# EAGLE design team4-selo-atmega32u4-usb (EAGLE 9.5.1)

## Sheet 1 of 2
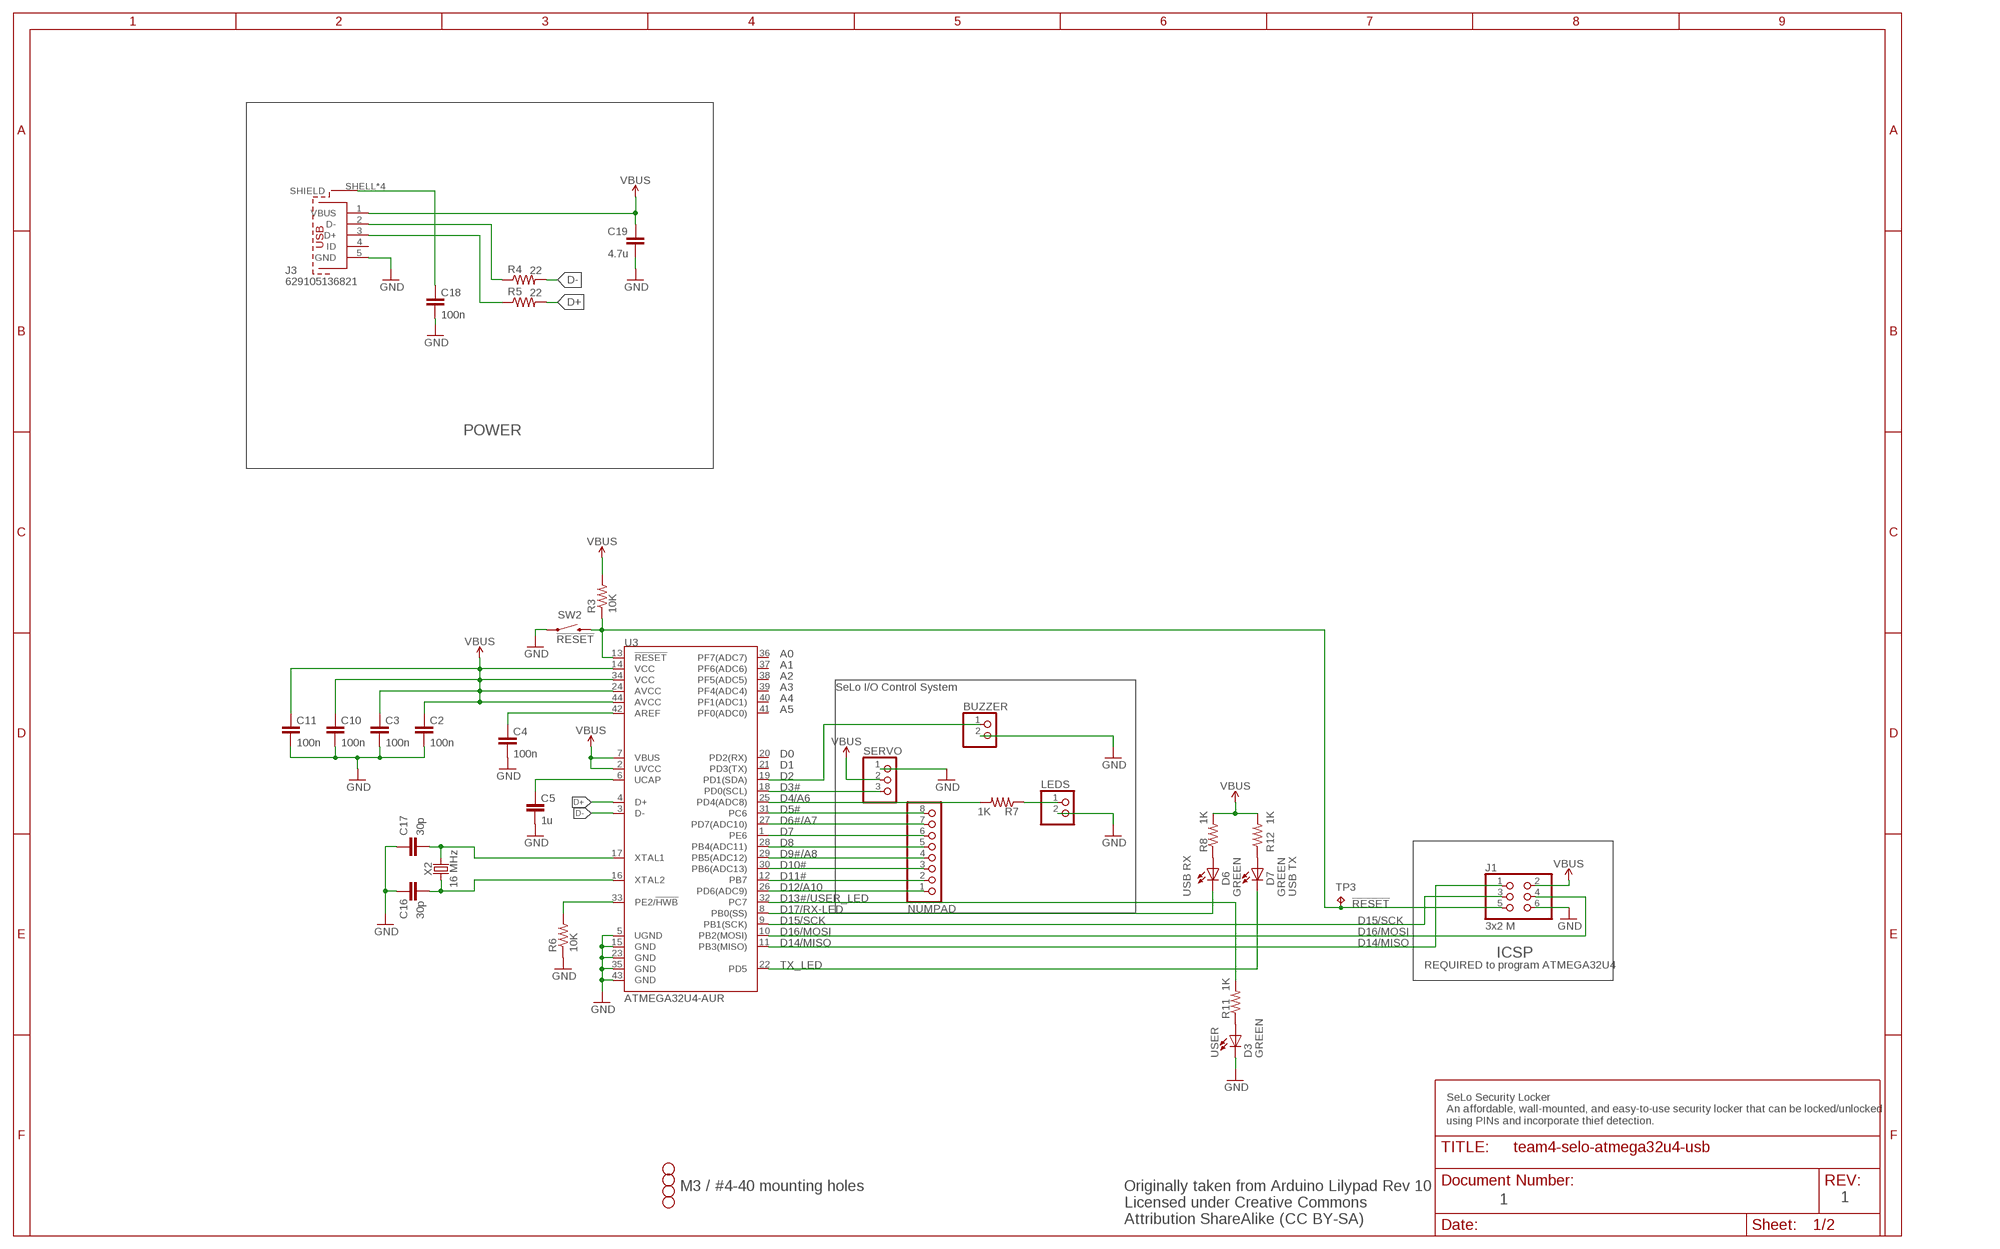
[diagram p0: schematic, sheet 1]

### Parts
BUZZER  PINHD-1X2  [1X02]
C2  100n  C-EUC0805K  [C0805K]
C3  100n  C-EUC0805K  [C0805K]
C4  100n  C-EUC0805K  [C0805K]
C5  1u  C-EUC0805K  [C0805K]
C10  100n  C-EUC0805K  [C0805K]
C11  100n  C-EUC0805K  [C0805K]
C16  30p  C-EUC0805K  [C0805K]
C17  30p  C-EUC0805K  [C0805K]
C18  100n  C-EUC0805K  [C0805K]
C19  4.7u  C-EUC0805K  [C0805K]
D3  GREEN  LEDCHIP-LED0805  [CHIP-LED0805]
D6  GREEN  LEDCHIP-LED0805  [CHIP-LED0805]
D7  GREEN  LEDCHIP-LED0805  [CHIP-LED0805]
H1  STAND-OFF  [STAND-OFF]
H2  STAND-OFF  [STAND-OFF]
H3  STAND-OFF  [STAND-OFF]
H4  STAND-OFF  [STAND-OFF]
J1  3x2 M  PINHD-2X3  [2X03]
J3  629105136821  [629105136821]
LEDS  PINHD-1X2  [1X02]
NUMPAD  PINHD-1X8  [1X08]
R3  10K  R-US_R0805  [R0805]
R4  22  R-US_R0805  [R0805]
R5  22  R-US_R0805  [R0805]
R6  10K  R-US_R0805  [R0805]
R7  1K  R-US_R0805  [R0805]
R8  1K  R-US_R0805  [R0805]
R11  1K  R-US_R0805  [R0805]
R12  1K  R-US_R0805  [R0805]
SERVO  PINHD-1X3  [1X03]
SW2  !RESET  SWITCH-MOMENTARY-2SMD  [TACTILE_SWITCH_SMD]
TP3  TPPAD1-13  [P1-13]
U3  ATMEGA32U4-AUR  ATMEGA32U4TQFP-44  [TQFP44]
X2  16 MHz  CRYSTALSMD-HC49UP  [HC49UP]

### Nets
!RESET: J1.5 R3.1 SW2.3 TP3.TP U3.13(!RESET)
AREF: C4.1 U3.42(AREF)
D13#/USER_LED: R11.2 U3.32(PC7)
D14/MISO: J1.1 U3.11(PB3(MISO))
D15/SCK: J1.3 U3.9(PB1(SCK))
D16/MOSI: J1.4 U3.10(PB2(MOSI))
D17/RX-LED: D6.C U3.8(PB0(SS))
D+: R5.2 U3.4(D+)
D-: R4.2 U3.3(D-)
GND: BUZZER.2 C2.2 C3.2 C4.2 C5.2 C10.2 C11.2 C16.2 C17.2 C18.2 C19.2 D3.C J1.6 J3.5(GND) LEDS.2 R6.1 SERVO.1 SW2.1 U3.5(UGND) U3.15(GND) U3.23(GND) U3.35(GND) U3.43(GND)
N$1: SERVO.3 U3.18(PD0(SCL))
N$2: NUMPAD.8 U3.31(PC6)
N$5: NUMPAD.7 U3.27(PD7(ADC10))
N$6: NUMPAD.6 U3.1(PE6)
N$8: NUMPAD.5 U3.28(PB4(ADC11))
N$9: NUMPAD.4 U3.29(PB5(ADC12))
N$10: NUMPAD.3 U3.30(PB6(ADC13))
N$11: NUMPAD.2 U3.12(PB7)
N$12: NUMPAD.1 U3.26(PD6(ADC9))
N$13: D3.A R11.1
N$14: C18.1 J3.SHELL1(SHIELD) J3.SHELL2(SHIELD) J3.SHELL3(SHIELD) J3.SHELL(SHIELD)
N$15: D6.A R8.1
N$16: D7.A R12.1
N$17: R7.2 U3.25(PD4(ADC8))
N$18: LEDS.1 R7.1
N$19: J3.2(D-) R4.1
N$20: J3.3(D+) R5.1
N$21: BUZZER.1 U3.19(PD1(SDA))
PE2/!HWB: R6.2 U3.33(PE2/!HWB)
TX_LED: D7.C U3.22(PD5)
UCAP: C5.1 U3.6(UCAP)
VBUS: C2.1 C3.1 C10.1 C11.1 C19.1 J1.2 J3.1(VBUS) R3.2 R8.2 R12.2 SERVO.2 U3.2(UVCC) U3.7(VBUS) U3.14(VCC) U3.24(AVCC) U3.34(VCC) U3.44(AVCC)
XTAL1: C17.1 U3.17(XTAL1) X2.2
XTAL2: C16.1 U3.16(XTAL2) X2.1
Unconnected: J3.4(ID) U3.20(PD2(RX)) U3.21(PD3(TX)) U3.36(PF7(ADC7)) U3.37(PF6(ADC6)) U3.38(PF5(ADC5)) U3.39(PF4(ADC4)) U3.40(PF1(ADC1)) U3.41(PF0(ADC0))

### Notes on the sheet
- POWER
- A0
- A1
- A2
- A3 | SeLo I/O Control System
- A4
- A5
- D0
- D1
- D2
- D3#
- D4/A6
- D5#
- D6#/A7
- D7
- D8
- D9#/A8
- D10#
- D11#
- D12/A10
- USB RX | USB TX
- ICSP
- REQUIRED to program ATMEGA32U4
- USER
- SeLo Security Locker
  An affordable, wall-mounted, and easy-to-use security locker that can be locked/unlocked 
  using PINs and incorporate thief detection.
- M3 / #4-40 mounting holes
- 1 | 1
- Originally taken from Arduino Lilypad Rev 10
  Licensed under Creative Commons 
  Attribution ShareAlike (CC BY-SA)

## Sheet 2 of 2

## Library data of the parts
BUZZER LEDS = pinhead:PINHD-1X2: PIN HEADER
C2-C4 C10 C11 C18 = rcl:C-EU: CAPACITOR, European symbol; DESC: CAP CER 0.1UF 50V X7R 0805; MFR: Samsung; MPN: CL21B104KBCNNNC; SPICEPREFIX: C
C5 = rcl:C-EU: CAPACITOR, European symbol; DESC: CAP CER 1UF 16V X7R 0805; MFR: Samsung; MPN: CL21B105KOFNNNG; SPICEPREFIX: C
C16 = rcl:C-EU: CAPACITOR, European symbol; DESC: CAP CER 30PF 50V C0G/NP0 0805; MFR: Samsung; MPN: CL21C300JBANNNC; SPICEPREFIX: C
C17 = rcl:C-EU: CAPACITOR, European symbol; DESC: CAP CER 30PF 50V C0G/NP0 0805; MFR: Samsung; MPN: CL21C180JBANNNC; SPICEPREFIX: C
C19 = rcl:C-EU: CAPACITOR, European symbol; DESC: CAP CER 4.7UF 16V X5R 0805; MFR: Samsung; MPN: CL21A475KOFNNNE; SPICEPREFIX: C
D3 D6 D7 = led:LED: LED OSRAM: - CHIPLED LG R971, LG N971, LY N971, LG Q971, LY Q971, LO R971, LY R971 LH N974, LH R974 LS Q976, LO Q976, LY Q976 LO Q996 - Hyper CHIPLED LW Q18S LB Q993, LB Q99A, LB R99A - SideLED LS A670, LO A670, LY A670, LG A670, LP A670 LB A673, LV A673, LT A673, LW A673 LH A674 LY A675 LS A676, LA A676, LO A676, LY A676, LW A676 LS A679, LY A679, LG A679 - Hyper Micro SIDELED® LS Y876, LA Y876, LO Y876, LY Y876 LT Y87S - SmartLED LW L88C, LW L88S LB L89C, LB L89S, LG L890 LS L89K, LO L89K, LY L89K LS L896, LA L896, LO L896, LY L896 - TOPLED LS T670, LO T670, LY T670, LG T670, LP T670 LSG T670, LSP T670, LSY T670, LOP T670, LYG T670 LG T671, LOG T671, LSG T671 LB T673, LV T673, LT T673, LW T673 LH T674 LS T676, LA T676, LO T676, LY T676, LB T676, LH T676, LSB T676, LW T676 LB T67C, LV T67C, LT T67C, LS T67K, LO T67K, LY T67K, LW E67C LS E67B, LA E67B, LO E67B, LY E67B, LB E67C, LV E67C, LT E67C LW T67C LS T679, LY T679, LG T679 LS T770, LO T770, LY T770, LG T770, LP T770 LB T773, LV T773, LT T773, LW T773 LH T774 LS E675, LA E675, LY E675, LS T675 LS T776, LA T776, LO T776, LY T776, LB T776 LHGB T686 LT T68C, LB T68C - Hyper Mini TOPLED® LB M676 - Mini TOPLED Santana® LG M470 LS M47K, LO M47K, LY M47K Source: http://www.osram.convergy.de LUXEON: - LUMILED® LXK2-PW12-R00, LXK2-PW12-S00, LXK2-PW14-U00, LXK2-PW14-V00 LXK2-PM12-R00, LXK2-PM12-S00, LXK2-PM14-U00 LXK2-PE12-Q00, LXK2-PE12-R00, LXK2-PE12-S00, LXK2-PE14-T00, LXK2-PE14-U00 LXK2-PB12-K00, LXK2-PB12-L00, LXK2-PB12-M00, LXK2-PB14-N00, LXK2-PB14-P00, LXK2-PB14-Q00 LXK2-PR12-L00, LXK2-PR12-M00, LXK2-PR14-Q00, LXK2-PR14-R00 LXK2-PD12-Q00, LXK2-PD12-R00, LXK2-PD12-S00 LXK2-PH12-R00, LXK2-PH12-S00 LXK2-PL12-P00, LXK2-PL12-Q00, LXK2-PL12-R00 Source: www.luxeon.com KINGBRIGHT: KA-3528ASYC Source: www.kingbright.com; DESC: LED GREEN CLEAR 0805 SMD; MFR: Würth Elektronik; MPN: 150080GS75000
H1-H4 = SparkFun-Hardware:STAND-OFF: Stand Off Drill holes for mechanically mounting via screws, standoffs, etc. Note: Use the keepout ring to avoid running the screw head into surrounding components. Variant Overviews STAND-OFF - Mechanical footprint for a #4 phillips button head screw. STAND-OFF-TIGHT - Mechanical footprint for a #4 phillips button head screw, Example SparkFun Products Screw - Phillips Head (1/4", 4-40, 10 pack) <https://www.sparkfun.com/products/10453> (PRT-10453) Screw - Phillips Head (1/2", 4-40, 10 pack) <https://www.sparkfun.com/products/10452> (PRT-10452) Screw - Phillips Head (3/4", 4-40, 10 pack) <https://www.sparkfun.com/products/10451> (PRT-10451) Screw - Phillips Head (1", 4-40, 10 pack) <https://www.sparkfun.com/products/10450> (PRT-10450)
J1 = SmartPrj:PINHD-2X3: PIN HEADER; DESC: CONN HEADER VERT 6POS 2ROW 2.54MM; MFR: Harwin; MPN: M20-9980345
J3 = Wurth_Elektronik_Electromechanic_Input-Output_Connectors_rev19b:629105136821: WR-COM SMT Horizontal 5 Contacts Micro USB Type B,5 pins=>Code : Con_I-O_COM_MicroUSB_629105136821 <http://katalog.we-online.de/media/images/eican/Con_I-O_COM_MicroUSB_629105136821_pf2.jpg> Details see: http://katalog.we-online.de/en/em/COM_MICRO_SMT_TYPE_B_HORIZONTAL/629105136821?m Created 2014-07-09, Karrer Zheng 2014 (C) Würth Elektronik; DESC: CONN RCPT USB2.0 MICRO B SMD R/A; MFR: Wurth; MPN: 629105136821
NUMPAD = pinhead:PINHD-1X8: PIN HEADER
R3 R6 = rcl:R-US_: RESISTOR, American symbol; DESC: RES SMD 10K OHM 1% 1/8W 0805; MFR: Yageo; MPN: RC0805FR-0710KL; SPICEPREFIX: R
R4 R5 = rcl:R-US_: RESISTOR, American symbol; DESC: RES SMD 22 OHM 1% 1/8W 0805; MFR: Yageo; MPN: RC0805FR-0722RL; SPICEPREFIX: R
R7 R8 R11 R12 = rcl:R-US_: RESISTOR, American symbol; DESC: RES SMD 1K OHM 1% 1/8W 0805; MFR: Yageo; MPN: RC0805FR-071KL; SPICEPREFIX: R
SERVO = pinhead:PINHD-1X3: PIN HEADER
SW2 = SparkFun-Electromechanical:SWITCH-MOMENTARY-2: Various NO switches- pushbuttons, reed, etc; DESC: SWITCH TACTILE SPST-NO 0.05A 12V; MFR: C&K; MPN: RS-187R05A2-DS MT RT
TP3 = testpad:TP: Test pad
U3 = SparkFun-IC-Microcontroller:ATMEGA32U4: Atmel MCU, 32KByte Atmel 44-pin 8-bit Microcontroller with 32KBytes of ISP Flash and USB Controller Datasheet <http://cdn.sparkfun.com/datasheets/Dev/Arduino/Boards/ATMega32U4.pdf> SparkFun Products LilyPad Arduino USB - ATmega32U4 Board <https://www.sparkfun.com/products/12049> (DEV-12049) Pro Micro - 5V/16MHz <https://www.sparkfun.com/products/12640> (DEV-12640) Pro Micro - 3.3V/8MHz <https://www.sparkfun.com/products/12587> (DEV-12587) Fio v3 - ATmega32U4 <https://www.sparkfun.com/products/11520> (DEV-11520) Qduino Mini <https://www.sparkfun.com/products/13614> (DEV-13614) Makey Makey - Standard Kit <https://www.sparkfun.com/products/11511> (WIG-11511) Makey Makey Deluxe Kit <https://www.sparkfun.com/products/11519> (WIG-11519); DESC: IC MCU 8BIT 32KB FLASH 44TQFP; MFR: Microchip; MPN: ATMEGA32U4-AUR; PROD_ID: IC-10828; VALUE: 32U4
X2 = SparkFun-Clocks:CRYSTAL: Crystals (Generic) These are passive quartz crystals, which can be used as a clock source for a microcontroller. Crystal's are two-terminal devices. They require external "load" capacitors to generate an oscillating signal.; DESC: CRYSTAL 16.000 MHZ 18PF SMD; MFR: ECS; MPN: ECS-160-18-5PX-TR

## Net classes
0 default: width 0.254 mm, clearance 0.254 mm
1 power: width 0.61 mm, drill 0.61 mm, clearance 0.254 mm

## Board
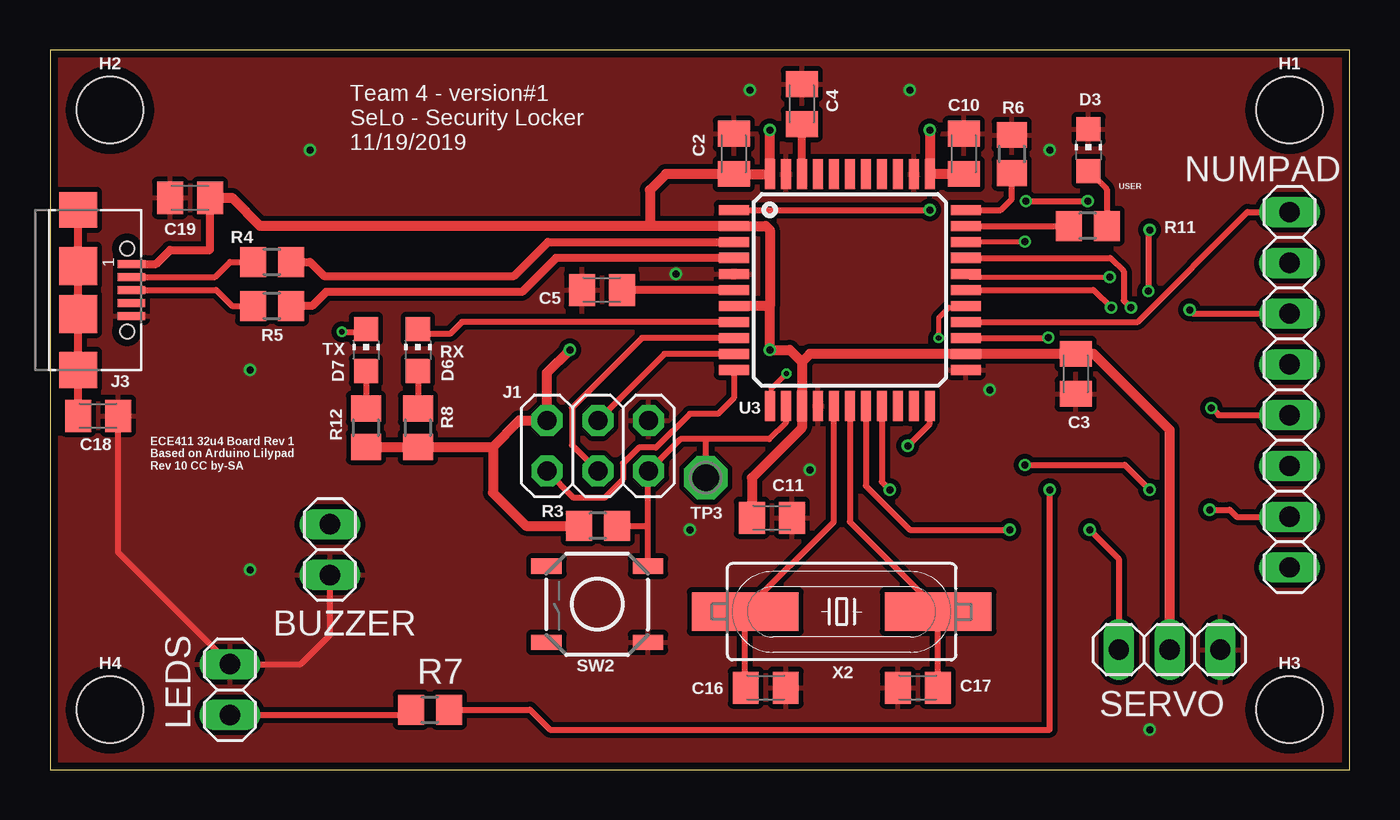
[diagram p1: board, top side]
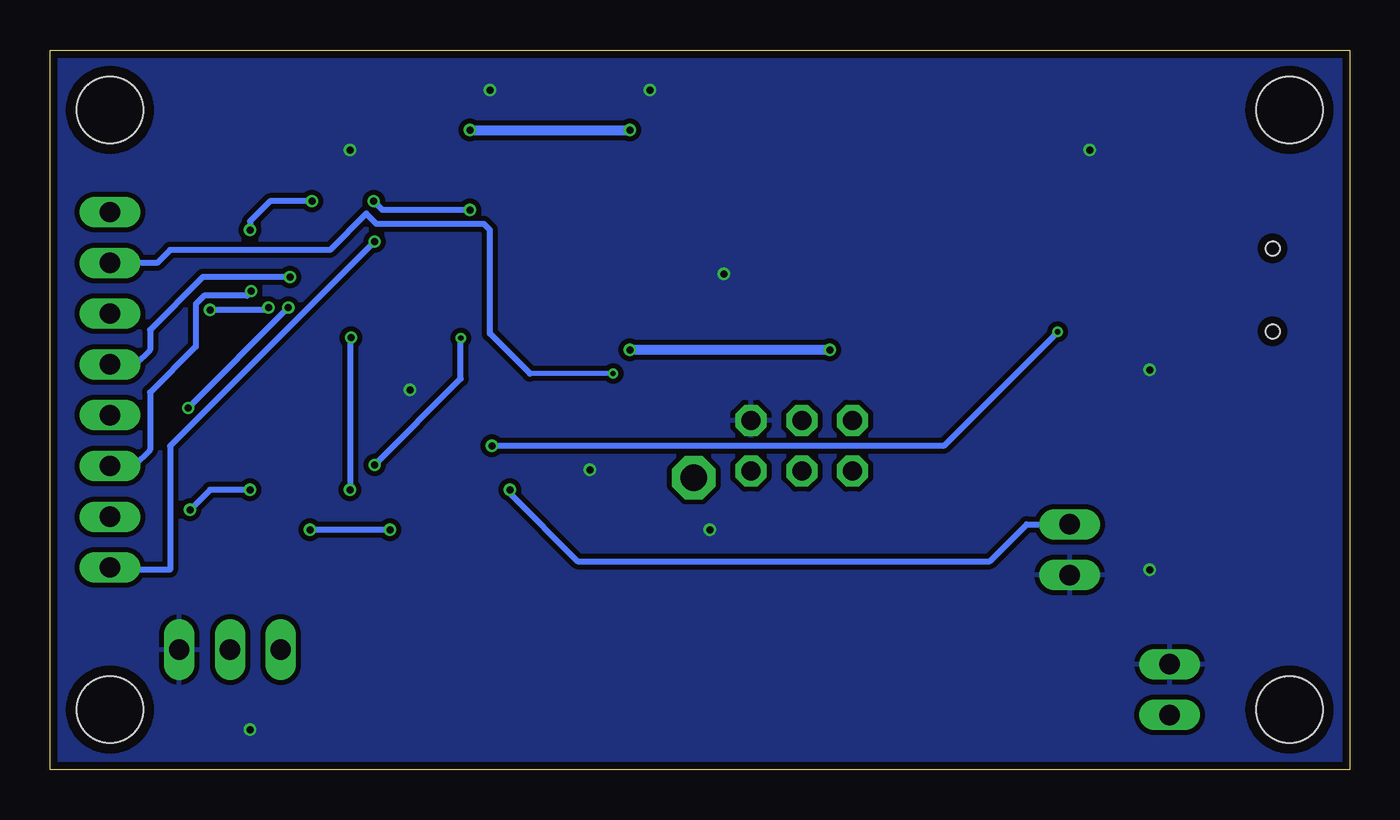
[diagram p2: board, bottom side, seen from below]

Size 65 x 36 mm. Coordinates in mm from the lower left corner, seen from the top.
Outline: 0,0 65,0 65,36 0,36 0,0
Copper layers (1*16): Top 0.035559375mm / dielectric 1.6mm / Bottom 0.035559375mm
Design rules "oshpark-2layer *": minimum track width 6mil, minimum drill 10mil, track to track 6mil, track to pad 6mil, pad to pad 6mil, via to via 6mil, smd to smd 6mil, copper to edge 15mil, drill to drill 6mil, minimum pad ring 5mil, minimum via ring 5mil, stop-mask expansion 2.5mil, vias tented up to drill 0.4mm, thermal gap 10mil

### Footprints (pad centres in the part's own frame; a part is rotated, then mirrored left to right if it is on the bottom)
1X02 = drill 1.016 long: 1 -1.27,0; 2 1.27,0
C0805K = smd 1.3 x 1.6: 1 -1,0; 2 1,0
CHIP-LED0805 = smd 1.2 x 1.2: A 0,-1.05; C 0,1.05
STAND-OFF = hole 3.302: 0,0
2X03 = drill 0.95 pad 1.55 octagon: 1 -2.54,-1.27; 2 -2.54,1.27; 3 0,-1.27; 4 0,1.27; 5 2.54,-1.27; 6 2.54,1.27
629105136821 = smd 0.4 x 1.35: 1 -1.3,2.675; 2 -0.65,2.675; 3 0,2.675; 4 0.65,2.675; 5 1.3,2.675 | smd 1.8 x 1.9: SHELL -4,0; SHELL3 4,0 | smd 1.9 x 1.9: SHELL1 -1.2,0; SHELL2 1.2,0 | hole 0.7: -2.075,2.45; 2.075,2.45
1X08 = drill 1.016 long: 1 -8.89,0; 2 -6.35,0; 3 -3.81,0; 4 -1.27,0; 5 1.27,0; 6 3.81,0; 7 6.35,0; 8 8.89,0
R0805 = smd 1.3 x 1.5: 1 -0.95,0; 2 0.95,0
1X03 = drill 1.016 long: 1 -2.54,0; 2 0,0; 3 2.54,0
TACTILE_SWITCH_SMD = smd 1.524 x 0.762: 1 -2.54,1.905; 2 2.54,1.905; 3 -2.54,-1.905; 4 2.54,-1.905
P1-13 = drill 1.321 pad 2.159 octagon: TP 0,0
TQFP44 = smd 1.5 x 0.5: 1 -5.8,4; 2 -5.8,3.2; 3 -5.8,2.4; 4 -5.8,1.6; 5 -5.8,0.8; 6 -5.8,0; 7 -5.8,-0.8; 8 -5.8,-1.6; 9 -5.8,-2.4; 10 -5.8,-3.2; 11 -5.8,-4; 23 5.8,-4; 24 5.8,-3.2; 25 5.8,-2.4; 26 5.8,-1.6; 27 5.8,-0.8; 28 5.8,0; 29 5.8,0.8; 30 5.8,1.6; 31 5.8,2.4; 32 5.8,3.2; 33 5.8,4 | smd 0.5 x 1.5: 12 -4,-5.8; 13 -3.2,-5.8; 14 -2.4,-5.8; 15 -1.6,-5.8; 16 -0.8,-5.8; 17 0,-5.8; 18 0.8,-5.8; 19 1.6,-5.8; 20 2.4,-5.8; 21 3.2,-5.8; 22 4,-5.8; 34 4,5.8; 35 3.2,5.8; 36 2.4,5.8; 37 1.6,5.8; 38 0.8,5.8; 39 0,5.8; 40 -0.8,5.8; 41 -1.6,5.8; 42 -2.4,5.8; 43 -3.2,5.8; 44 -4,5.8
HC49UP = smd 5.334 x 1.93: 1 -4.826,0; 2 4.826,0

### Placement (x,y rotation side)
BUZZER  14,11 270 top
C2  34.2,30.8 90 top
C3  51.3,19.8 270 top
C4  37.6,33.3 90 top
C5  27.6,24 180 top
C10  45.7,30.8 90 top
C11  36.1,12.6 0 top
C16  35.8,4.1 0 top
C17  43.4,4.1 180 top
C18  2.4,17.7 0 top
C19  7,28.6 180 top
D3  51.94,30.99 0 top
D6  18.4,21 0 top
D7  15.8,21 0 top
H1  62,33 0 top
H2  3,33 0 top
H3  62,3 0 top
H4  3,3 0 top
J1  27.4,16.2 0 top
J3  1.4,24 270 top
LEDS  9,4 90 top
NUMPAD  62,19 270 top
R3  27.4,12.2 180 top
R4  11.1,25.4 0 top
R5  11.1,23.2 0 top
R6  48.1,30.8 270 top
R7  19,3 0 top
R8  18.4,17.1 270 top
R11  51.9,27.2 180 top
R12  15.8,17.1 270 top
SERVO  56,6 180 top
SW2  27.37,8.27 180 top
TP3  32.8,14.6 0 top
U3  40,24 0 top
X2  39.6,7.9 0 top

### Tracks (layer width: path | path; a pad name or v marks a point on that pad's centre or on a via)
!RESET
  Top 0.3: U3.13 36.8,17.35 35.97,16.53 32.8,16.53 | 32.8,16.53 31.54,16.53 J1.5 29.91,14.9 29.91,12.2 | SW2.3 29.91,12.2 | TP3.TP 32.8,16.53 | R3.1 29.91,12.2
AREF
  Top 0.4: U3.42 C4.1
D13#/USER_LED
  Top 0.3: U3.32 R11.2
D14/MISO
  Top 0.3: U3.11 34.2,18.6 33.4,17.8 32,17.8 30.31,16.11 29.45,16.11 28.66,15.32 28.66,14.52 27.74,13.6 26.19,13.6 J1.1
D15/SCK
  Top 0.3: U3.9 29.6,21.6 26.1,18.1 26.1,16.23 J1.3
D16/MOSI
  Top 0.3: U3.10 30.73,20.8 J1.4
D17/RX-LED
  Top 0.3: U3.8 20.6,22.4 20,21.8 18.65,21.8 D6.C
D+
  Top 0.4: U3.4 25.3,25.6 23.6,23.9 13.8,23.9 13.1,23.2 R5.2
D-
  Top 0.4: R4.2 13,25.4 13.7,24.7 23.2,24.7 24.9,26.4 U3.3
GND  (via drill 0.35)
  Top 0.3: C18.2 3.4,10.87 LEDS.2 12.54,5.27 14,6.73 BUZZER.2
  other vias: 38,15 47,19 43,34 31.3,24.8 32,12 35,34 50,31 10,10 10,20 55,2 13,31
  pour Top (isolate 0.254): 0,0 65,0 65,36 0,36
  pour Bottom (isolate 0.254): 0,0 65,0 65,36 0,36
N$1  (via drill 0.35)
  Top 0.3: U3.18 40.8,14.2 43,12 v48,12 | v52,12 53.46,10.54 SERVO.3
  Bottom 0.3: v48,12 v52,12
N$2  (via drill 0.35)
  Top 0.254: v48.77,26.42 45.97,26.42 U3.31
  Bottom 0.3: v48.77,26.42 59,16.18 59,10 61.89,10 NUMPAD.8
N$5  (via drill 0.25, 0.35)
  Top 0.254: v44.45,21.59 44.45,22.61 44.96,23.11 45.72,23.11 U3.27
  Top 0.3: v48.77,15.24 53.76,15.24 v55,14 | v58,13 59,13 59.35,12.65 NUMPAD.7
  Bottom 0.3: v44.45,21.59 44.45,19.56 v48.77,15.24 | v55,14 57,14 v58,13
N$6  (via drill 0.35)
  Top 0.3: U3.1 v44,28 | v48.81,28.44 v51.9,28.44 | v51.9,28.44 | v55,27 54.93,26.93 v54.93,23.93
  Bottom 0.3: v44,28 48.37,28 v48.81,28.44 | v51.9,28.44 54,28.44 55,27.44 v55,27 | v54.93,23.93 55.16,23.71 57.29,23.71 57.71,23.29 57.71,21.16 60,18.87 60,16 60.81,15.19 NUMPAD.6
N$8  (via drill 0.35)
  Top 0.3: U3.28 52.18,24 v53.08,23.11 | v58.09,18.09 58.45,17.73 NUMPAD.5
  Bottom 0.3: v53.08,23.11 v58.09,18.09
N$9  (via drill 0.35)
  Top 0.254: v53,24.64 45.97,24.64 U3.29
  Bottom 0.3: v53,24.64 57.36,24.64 60,22 60,21 60.73,20.27 NUMPAD.4
N$10  (via drill 0.35)
  Top 0.3: v54.08,23.11 53.71,23.48 53.71,24.93 53.04,25.6 U3.30 | v57,23 57.19,22.81 NUMPAD.3
  Bottom 0.3: v54.08,23.11 54.18,23 v57,23
N$11  (via drill 0.25)
  Top 0.254: v36.83,19.81 36.07,19.05 36.07,18.29 U3.12
  Bottom 0.254: v36.83,19.81 41,19.81
  Bottom 0.3: 41,19.81 43,21.81 43,27 43.29,27.29 48.66,27.29 49.18,27.82 51,26 59,26 59.65,25.35 NUMPAD.2
N$12
  Top 0.3: U3.26 54.4,22.4 59.89,27.89 NUMPAD.1
N$13
  Top 0.3: D3.A 52.85,29.04 R11.1
N$14
  Top 0.4: C18.1 J3.SHELL3 J3.SHELL2 J3.SHELL1 J3.SHELL
N$15
  Top 0.3: D6.A R8.1
N$16
  Top 0.3: D7.A R12.1
N$17  (via drill 0.35)
  Top 0.3: v50,14 50,2 25,2 24,3 R7.2 | v49.94,21.61 v49.94,21.6 U3.25
  Bottom 0.3: v49.94,21.61 50,21.55 v50,14
N$18
  Top 0.3: LEDS.1 17.78,2.73 R7.1
N$19
  Top 0.3: J3.2 8.25,24.65 9,25.4 R4.1
N$20
  Top 0.3: J3.3 8.3,24 9.1,23.2 R5.1
N$21  (via drill 0.35)
  Top 0.3: U3.19 41.6,14.4 v42,14
  Bottom 0.3: v42,14 42,13.81 38.61,10.41 18,10.41 16.14,12.27 BUZZER.1
PE2/!HWB
  Top 0.3: U3.33 47.55,28 48.1,28.55 R6.2
TX_LED  (via drill 0.25, 0.35)
  Top 0.3: v14.6,21.9 15.65,21.9 D7.C | v42.9,16.2 44,17.3 U3.22
  Bottom 0.3: v42.9,16.2 20.3,16.2 v14.6,21.9
UCAP
  Top 0.4: U3.6 C5.1
VBUS  (via drill 0.35)
  Top 0.4: J3.1 5.3,25.3 6,26 8,26 C19.1
  Top 0.5: 30,27.2 U3.2 35.8,27.2 36,27 36,23.2 | 30,27.2 10.5,27.2 9.1,28.6 C19.1 | C11.1 35.1,14.6 37.6,17.1 U3.14 37.6,20.4 | C10.1 U3.34 v44,32 | 36,23.2 U3.7 | R12.2 R8.2 22.15,16.15 | 22.15,16.15 23.47,17.47 J1.2 24.86,19.86 v26,21 | 36,23.2 v36,21 37,21 37.6,20.4 | 37.6,20.4 38,20.8 U3.24 C3.1 52.2,20.8 56,17 SERVO.2 | v36,32 U3.44 C2.1 30.8,29.8 30,29 30,27.2 | 22.15,16.15 22.15,13.85 23.8,12.2 R3.2
  Bottom 0.5: v26,21 v36,21 | v44,32 v36,32
XTAL1
  Top 0.3: U3.17 40,12.4 44.43,7.97 X2.2 44.4,7.87 C17.1
XTAL2
  Top 0.3: U3.16 39.2,12.4 34.77,7.97 X2.1 34.77,4.13 C16.1

### Text on the board
tPlace: Team 4 - version#1 / SeLo - Security Locker / 11/19/2019 | USER | TX | RX | ECE411 32u4 Board Rev 1 / Based on Arduino Lilypad / Rev 10 CC by-SA